# Altium schematic sheet BatteryConnectivity.SchDoc
size A0
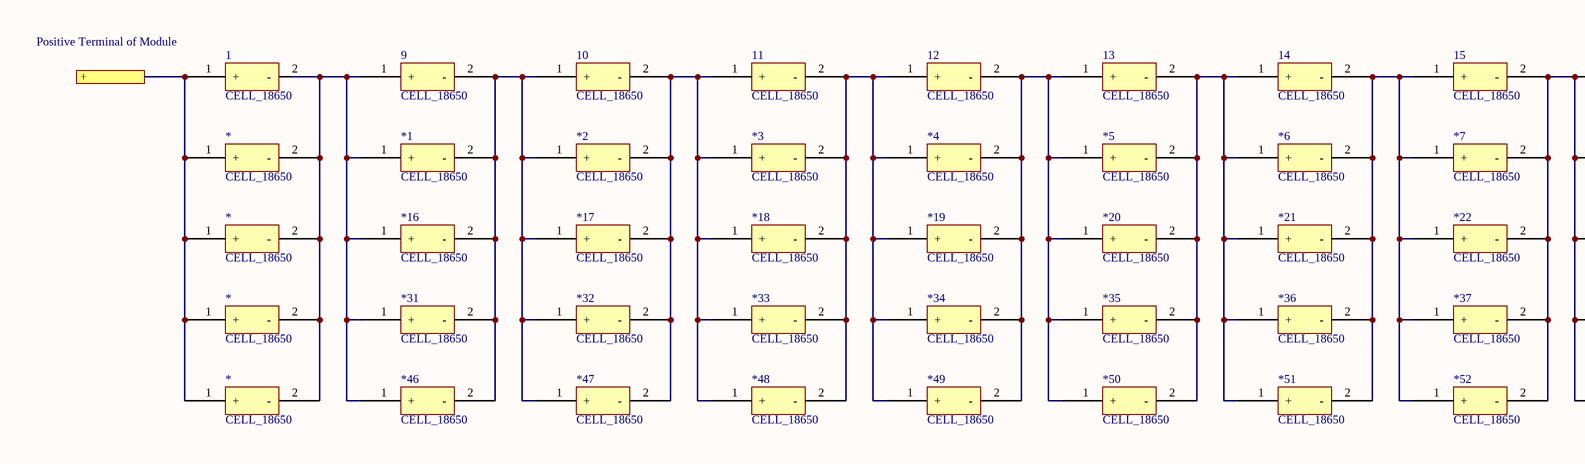
[diagram p0: BatteryConnectivity.SchDoc, left]
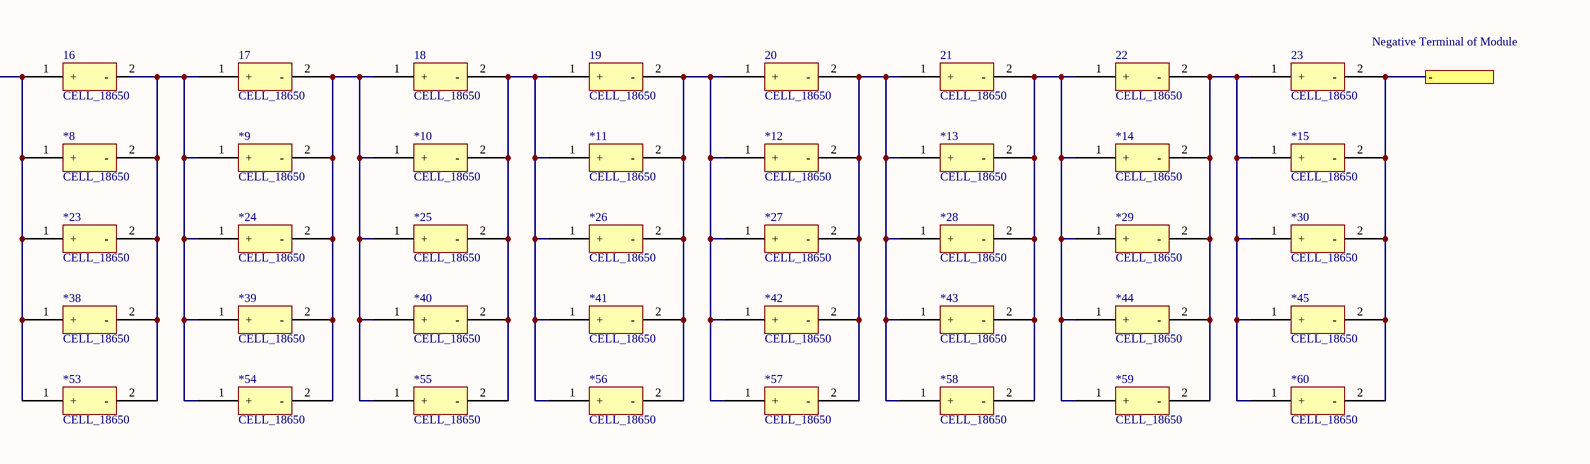
[diagram p1: BatteryConnectivity.SchDoc, right]

## Parts
(Parts that share a designator on the sheet are numbered #1, #2 ... from top to bottom, then left to right.)
1  CELL_18650
9  CELL_18650
10  CELL_18650
11  CELL_18650
12  CELL_18650
13  CELL_18650
14  CELL_18650
15  CELL_18650
16  CELL_18650
17  CELL_18650
18  CELL_18650
19  CELL_18650
20  CELL_18650
21  CELL_18650
22  CELL_18650
23  CELL_18650
*1  CELL_18650
*2  CELL_18650
*3  CELL_18650
*4  CELL_18650
*5  CELL_18650
*6  CELL_18650
*7  CELL_18650
*8  CELL_18650
*9  CELL_18650
*10  CELL_18650
*11  CELL_18650
*12  CELL_18650
*13  CELL_18650
*14  CELL_18650
*15  CELL_18650
*16  CELL_18650
*17  CELL_18650
*18  CELL_18650
*19  CELL_18650
*20  CELL_18650
*21  CELL_18650
*22  CELL_18650
*23  CELL_18650
*24  CELL_18650
*25  CELL_18650
*26  CELL_18650
*27  CELL_18650
*28  CELL_18650
*29  CELL_18650
*30  CELL_18650
*31  CELL_18650
*32  CELL_18650
*33  CELL_18650
*34  CELL_18650
*35  CELL_18650
*36  CELL_18650
*37  CELL_18650
*38  CELL_18650
*39  CELL_18650
*40  CELL_18650
*41  CELL_18650
*42  CELL_18650
*43  CELL_18650
*44  CELL_18650
*45  CELL_18650
*46  CELL_18650
*47  CELL_18650
*48  CELL_18650
*49  CELL_18650
*50  CELL_18650
*51  CELL_18650
*52  CELL_18650
*53  CELL_18650
*54  CELL_18650
*55  CELL_18650
*56  CELL_18650
*57  CELL_18650
*58  CELL_18650
*59  CELL_18650
*60  CELL_18650
*#1  CELL_18650
*#2  CELL_18650
*#3  CELL_18650
*#4  CELL_18650

## Ports
+, -

## Nets
+: 1.1(+) *#1.1(+) *#2.1(+) *#3.1(+) *#4.1(+) ; port +
-: 23.2(-) *15.2(-) *30.2(-) *45.2(-) *60.2(-) ; port -
Net1_2: 1.2(-) 9.1(+) *1.1(+) *16.1(+) *31.1(+) *46.1(+) *#1.2(-) *#2.2(-) *#3.2(-) *#4.2(-)
Net9_2: 9.2(-) 10.1(+) *1.2(-) *2.1(+) *16.2(-) *17.1(+) *31.2(-) *32.1(+) *46.2(-) *47.1(+)
Net10_2: 10.2(-) 11.1(+) *2.2(-) *3.1(+) *17.2(-) *18.1(+) *32.2(-) *33.1(+) *47.2(-) *48.1(+)
Net11_2: 11.2(-) 12.1(+) *3.2(-) *4.1(+) *18.2(-) *19.1(+) *33.2(-) *34.1(+) *48.2(-) *49.1(+)
Net12_2: 12.2(-) 13.1(+) *4.2(-) *5.1(+) *19.2(-) *20.1(+) *34.2(-) *35.1(+) *49.2(-) *50.1(+)
Net13_2: 13.2(-) 14.1(+) *5.2(-) *6.1(+) *20.2(-) *21.1(+) *35.2(-) *36.1(+) *50.2(-) *51.1(+)
Net14_2: 14.2(-) 15.1(+) *6.2(-) *7.1(+) *21.2(-) *22.1(+) *36.2(-) *37.1(+) *51.2(-) *52.1(+)
Net15_2: 15.2(-) 16.1(+) *7.2(-) *8.1(+) *22.2(-) *23.1(+) *37.2(-) *38.1(+) *52.2(-) *53.1(+)
Net16_2: 16.2(-) 17.1(+) *8.2(-) *9.1(+) *23.2(-) *24.1(+) *38.2(-) *39.1(+) *53.2(-) *54.1(+)
Net17_2: 17.2(-) 18.1(+) *9.2(-) *10.1(+) *24.2(-) *25.1(+) *39.2(-) *40.1(+) *54.2(-) *55.1(+)
Net18_2: 18.2(-) 19.1(+) *10.2(-) *11.1(+) *25.2(-) *26.1(+) *40.2(-) *41.1(+) *55.2(-) *56.1(+)
Net19_2: 19.2(-) 20.1(+) *11.2(-) *12.1(+) *26.2(-) *27.1(+) *41.2(-) *42.1(+) *56.2(-) *57.1(+)
Net20_2: 20.2(-) 21.1(+) *12.2(-) *13.1(+) *27.2(-) *28.1(+) *42.2(-) *43.1(+) *57.2(-) *58.1(+)
Net21_2: 21.2(-) 22.1(+) *13.2(-) *14.1(+) *28.2(-) *29.1(+) *43.2(-) *44.1(+) *58.2(-) *59.1(+)
Net22_2: 22.2(-) 23.1(+) *14.2(-) *15.1(+) *29.2(-) *30.1(+) *44.2(-) *45.1(+) *59.2(-) *60.1(+)

## Notes on the sheet
- (near 1) Positive Terminal of Module
- (near 23) Negative Terminal of Module
- Title
- Size:
- Date:
- File:
- A0
- Number:
- Time:
- Revision:
- Sheet
- of